# Altium project gituar.PrjPcb
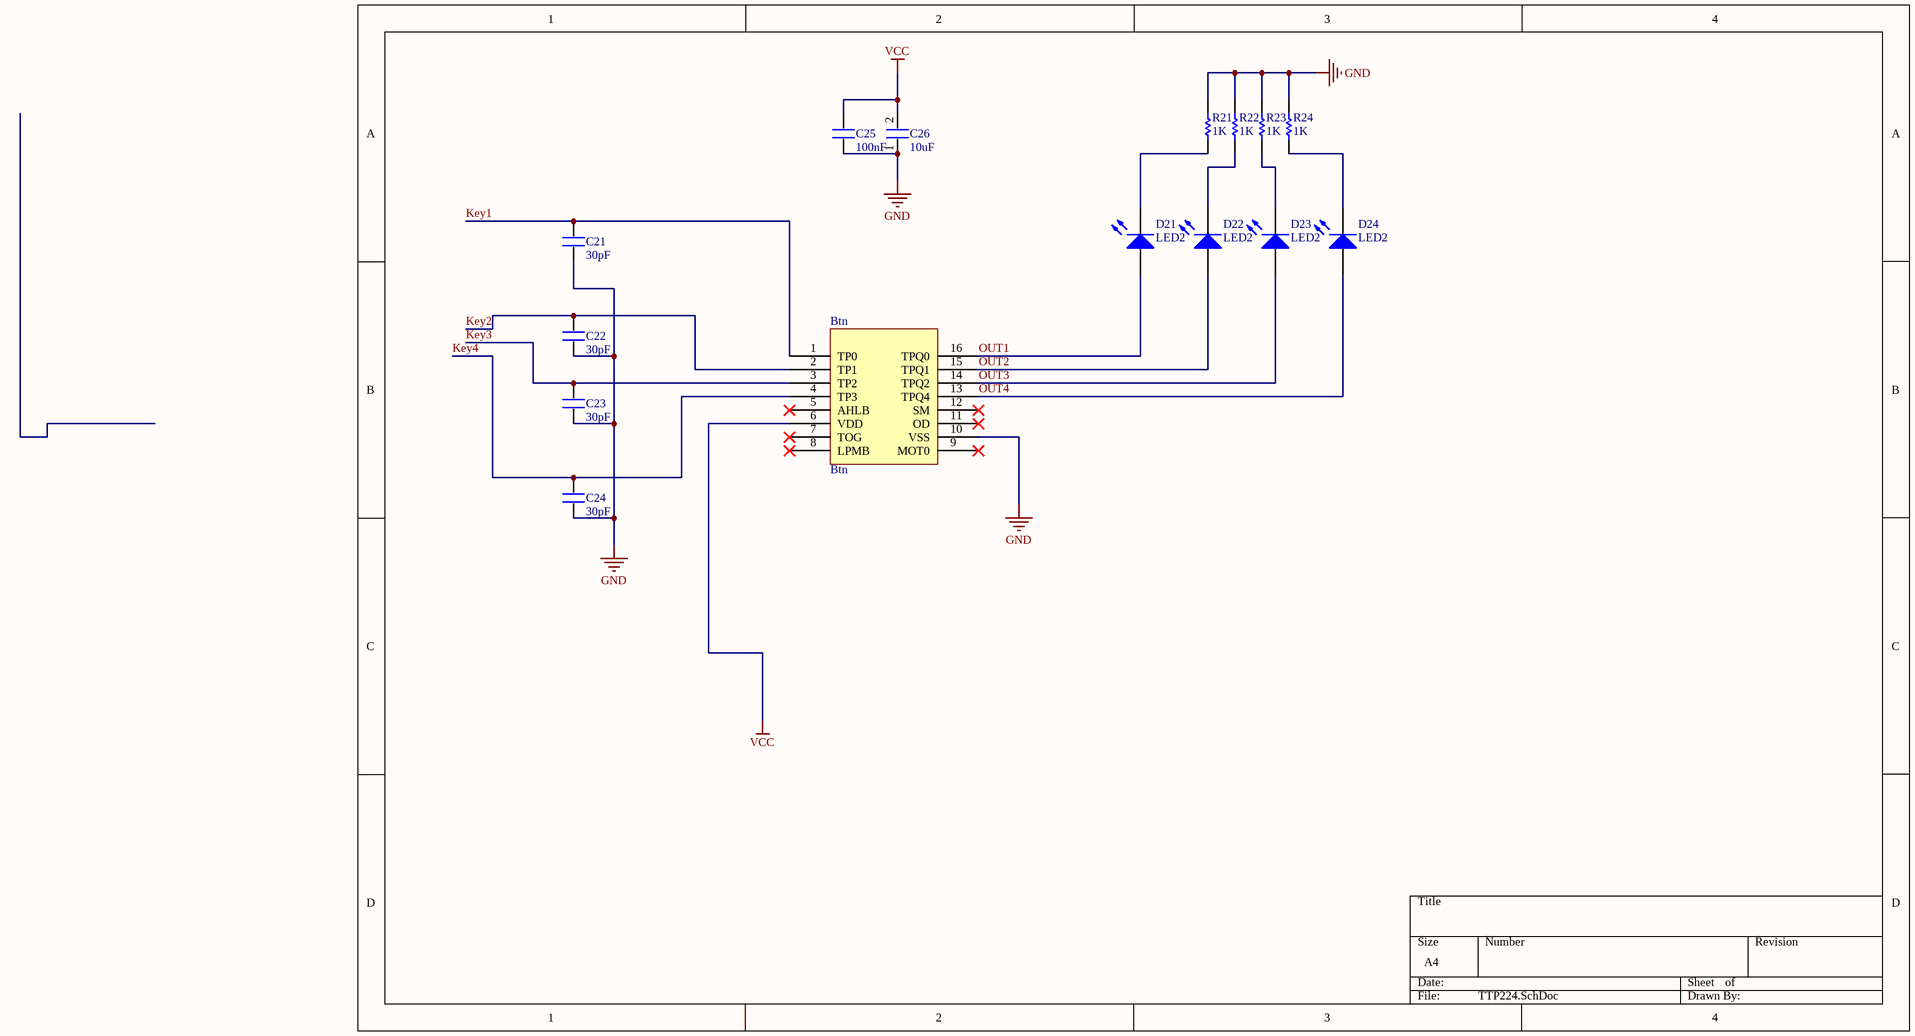
[diagram p0: TTP224.SchDoc]
2 sheets, 47 parts. Net scope: global (net labels, ports and power ports of the same name join across sheets).
Board file: PCB-never.PcbDoc
Sheets:
  TTP224.SchDoc
  Sheet1.SchDoc

## Sheet TTP224.SchDoc
size A4; SheetNumber: 1; SheetTotal: 2

### Parts
Btn  Btn  [SOP64P600X175-16N]
C21  value 30pF  [0805]  (hidden comment: CAP)
C22  value 30pF  [0805]  (hidden comment: CAP)
C23  value 30pF  [0805]  (hidden comment: CAP)
C24  value 30pF  [0805]  (hidden comment: CAP)
C25  value 100nF  [0805]  (hidden comment: CAP)
C26  value 10uF  [0805]  (hidden comment: CAP)
D21  LED2  [3.2X1.6X1.1]
D22  LED2  [3.2X1.6X1.1]
D23  LED2  [3.2X1.6X1.1]
D24  LED2  [3.2X1.6X1.1]
R21  Vaule: 1K  [0805]  (hidden comment: RES)
R22  Vaule: 1K  [0805]  (hidden comment: RES)
R23  Vaule: 1K  [0805]  (hidden comment: RES)
R24  Vaule: 1K  [0805]  (hidden comment: RES)

### Nets
GND: Btn.10(VSS) C21.1 C22.1 C23.1 C24.1 C25.1 C26.1 R21.2 R22.2 R23.2 R24.2
VCC: Btn.6(VDD) C25.2 C26.2
Key1: Btn.1(TP0) C21.2
Key2: Btn.2(TP1) C22.2
Key3: Btn.3(TP2) C23.2
Key4: Btn.4(TP3) C24.2
OUT1: Btn.16(TPQ0) D21.1(A)
OUT2: Btn.15(TPQ1) D22.1(A)
OUT3: Btn.14(TPQ2) D23.1(A)
OUT4: Btn.13(TPQ4) D24.1(A)
NetD21_2: D21.2(K) R21.1
NetD22_2: D22.2(K) R22.1
NetD23_2: D23.2(K) R23.1
NetD24_2: D24.2(K) R24.1

Not connected (* = marked no-connect by the designer): Btn 5(AHLB)* 7(TOG)* 8(LPMB)* 9(MOT0)* 11(OD)* 12(SM)*

### Library data of the parts
C21-C26 = CAP: Capacitor
D21-D24 = LED2: Typical RED, GREEN, YELLOW, AMBER GaAs LED; Published: 8-Jun-2000; LatestRevisionDate: 17-Jul-2002; LatestRevisionNote: Re-released for DXP Platform.; PackageVersion: Feb-2002; PackageReference: 3.2X1.6X1.1; Publisher: Altium Limited; PackageDescription: SM LED; 2 Flat Leads
R21-R24 = RES: Resistor

## Sheet Sheet1.SchDoc
size A4; SheetNumber: 2; SheetTotal: 2
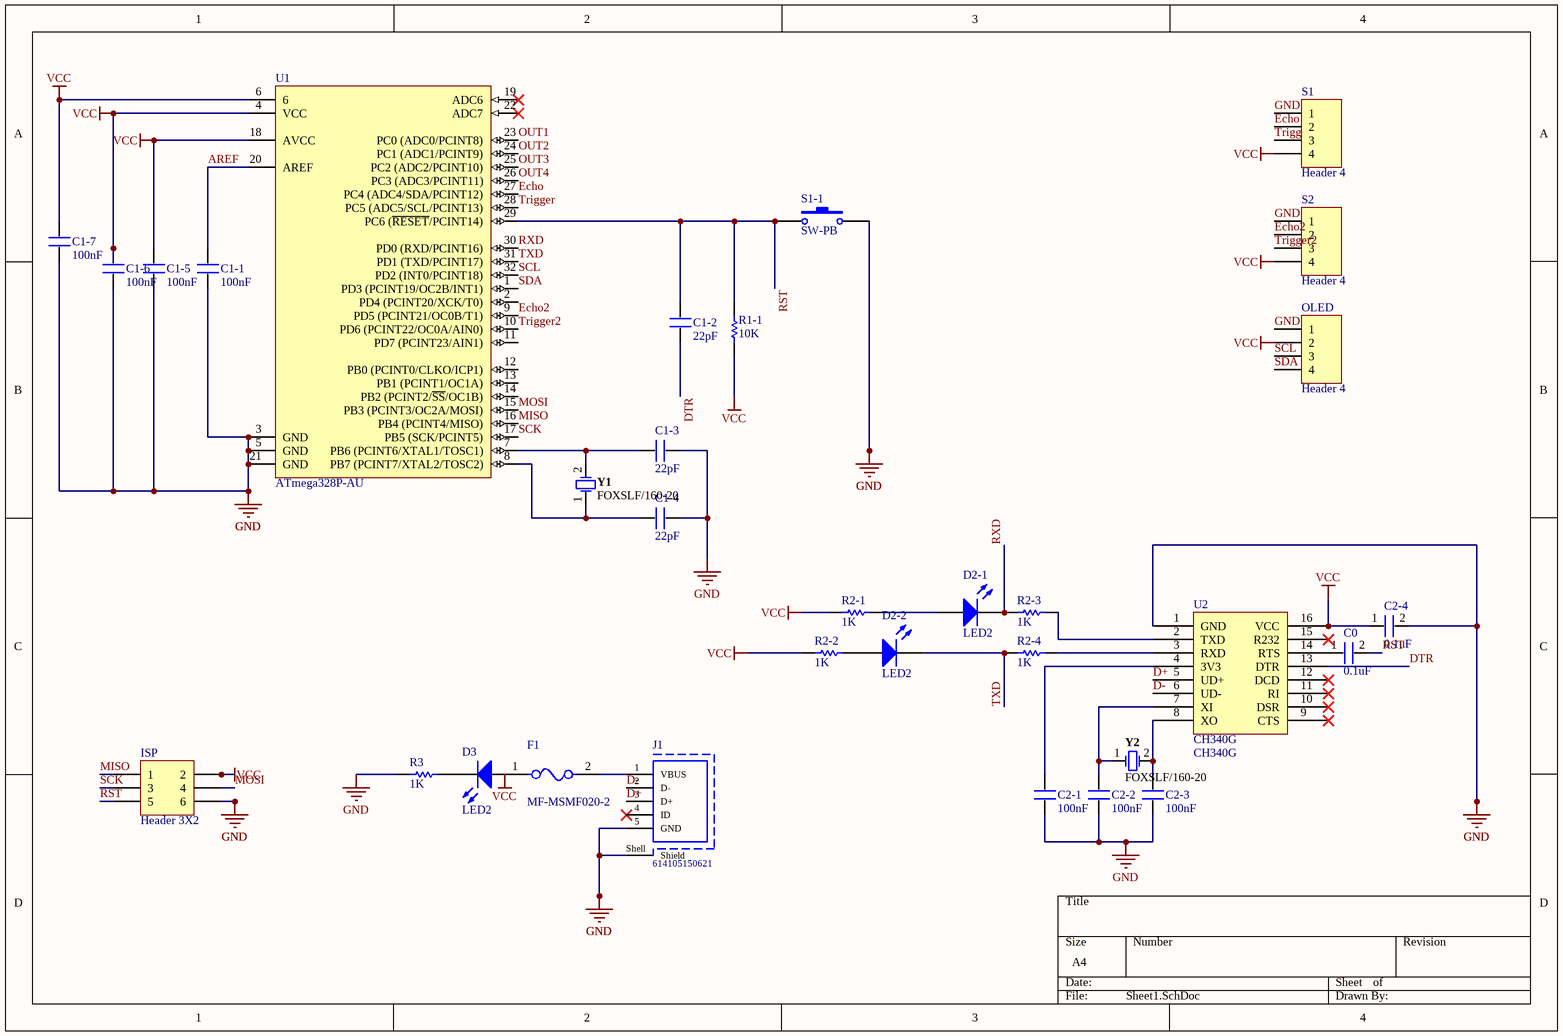
[diagram p1: Sheet1.SchDoc]

### Parts
C0  value 0.1uF  [0805]  (hidden comment: CAP)
C1-1  value 100nF  [0805]  (hidden comment: CAP)
C1-2  value 22pF  [0805]  (hidden comment: CAP)
C1-3  value 22pF  [0805]  (hidden comment: CAP)
C1-4  value 22pF  [0805]  (hidden comment: CAP)
C1-5  value 100nF  [0805]  (hidden comment: CAP)
C1-6  value 100nF  [0805]  (hidden comment: CAP)
C1-7  value 100nF  [0805]  (hidden comment: CAP)
C2-1  value 100nF  [0805]  (hidden comment: CAP)
C2-2  value 100nF  [0805]  (hidden comment: CAP)
C2-3  value 100nF  [0805]  (hidden comment: CAP)
C2-4  value 0.1uF  [0805]  (hidden comment: CAP)
D2-1  LED2  [3.2X1.6X1.1]
D2-2  LED2  [3.2X1.6X1.1]
D3  LED2  [3.2X1.6X1.1]
F1  MF-MSMF020-2  [FP-MF-MSMF020-2-MFG]
ISP  Header 3X2  [HDR2X3]
J1  614105150621  [629105150921]
OLED  Header 4  [HDR1X4]
R1-1  Vaule: 10K  [0805]  (hidden comment: RES)
R2-1  Vaule: 1K  [0805]  (hidden comment: RES)
R2-2  Vaule: 1K  [0805]  (hidden comment: RES)
R2-3  Vaule: 1K  [0805]  (hidden comment: RES)
R2-4  Vaule: 1K  [0805]  (hidden comment: RES)
R3  Vaule: 1K  [0805]  (hidden comment: RES)
S1  Header 4  [HDR1X4]
S1-1  SW-PB  [SPST-2]
S2  Header 4  [HDR1X4]
U1  ATmega328P-AU  [32A_L - duplicate]
U2  CH340G  [SOIC127P600X170-16N]
Y1  FOXSLF/160-20  [FOX-FOXSLF160-20]
Y2  FOXSLF/160-20  [FOX-FOXSLF160-20]

### Nets
GND: C1-1.1 C1-3.2 C1-4.2 C1-5.1 C1-6.1 C1-7.1 C2-1.1 C2-2.1 C2-3.1 C2-4.2 ISP.6 J1.5(GND) J1.Shell(Shield) OLED.1 R3.1 S1.1 S1-1.2 S2.1 U1.3(GND) U1.5(GND) U1.21(GND) U2.1(GND)
VCC: C1-5.2 C1-6.2 C1-7.2 C2-4.1 F1.1 ISP.2 OLED.2 R1-1.2 R2-1.1 R2-2.1 S1.4 S2.4 U1.4(VCC) U1.6 U1.18(AVCC) U2.16(VCC)
AREF: C1-1.2 U1.20(AREF)
D+: J1.3(D+) U2.5(UD+)
D-: J1.2(D-) U2.6(UD-)
DTR: C1-2.1 U2.13(DTR)
Echo: S1.2 U1.27(PC4_(ADC4/SDA/PCINT12))
Echo2: S2.2 U1.9(PD5_(PCINT21/OC0B/T1))
MISO: ISP.1 U1.16(PB4_(PCINT4/MISO))
MOSI: ISP.4 U1.15(PB3_(PCINT3/OC2A/MOSI))
OUT1: U1.23(PC0_(ADC0/PCINT8))
OUT2: U1.24(PC1_(ADC1/PCINT9))
OUT3: U1.25(PC2_(ADC2/PCINT10))
OUT4: U1.26(PC3_(ADC3/PCINT11))
RST: C0.2 C1-2.2 ISP.5 R1-1.1 S1-1.1 U1.29(PC6_(~{RESET}/PCINT14))
RXD: D2-1.2(K) R2-3.1 U1.30(PD0_(RXD/PCINT16))
SCK: ISP.3 U1.17(PB5_(SCK/PCINT5))
SCL: OLED.3 U1.32(PD2_(INT0/PCINT18))
SDA: OLED.4 U1.1(PD3_(PCINT19/OC2B/INT1))
Trigger: S1.3 U1.28(PC5_(ADC5/SCL/PCINT13))
Trigger2: S2.3 U1.10(PD6_(PCINT22/OC0A/AIN0))
TXD: D2-2.2(K) R2-4.1 U1.31(PD1_(TXD/PCINT17))
NetC0_1: C0.1 U2.14(RTS)
NetC1-3_1: C1-3.1 U1.7(PB6_(PCINT6/XTAL1/TOSC1)) Y1.2
NetC1-4_1: C1-4.1 U1.8(PB7_(PCINT7/XTAL2/TOSC2)) Y1.1
NetC2-1_2: C2-1.2 U2.4(3V3)
NetC2-2_2: C2-2.2 U2.7(XI) Y2.1
NetC2-3_2: C2-3.2 U2.8(XO) Y2.2
NetD2-1_1: D2-1.1(A) R2-1.2
NetD2-2_1: D2-2.1(A) R2-2.2
NetD3_2: D3.2(K) R3.2
NetF1_2: F1.2 J1.1(VBUS)
NetR2-3_2: R2-3.2 U2.2(TXD)
NetR2-4_2: R2-4.2 U2.3(RXD)

Not connected (* = marked no-connect by the designer): D3 1(A); J1 4(ID)*; U1 2(PD4_(PCINT20/XCK/T0)) 11(PD7_(PCINT23/AIN1)) 12(PB0_(PCINT0/CLKO/ICP1)) 13(PB1_(PCINT1/OC1A)) 14(PB2_(PCINT2/~{SS}/OC1B)) 19(ADC6)* 22(ADC7)*; U2 9(CTS)* 10(DSR)* 11(RI)* 12(DCD)* 15(R232)*

### Library data of the parts
C0 C1-1-C1-7 C2-1-C2-4 = CAP: Capacitor
D2-1 D2-2 D3 = LED2: as D21 on sheet TTP224; Published: 8-Jun-2000; LatestRevisionDate: 17-Jul-2002; LatestRevisionNote: Re-released for DXP Platform.; PackageVersion: Feb-2002; PackageReference: 3.2X1.6X1.1; Publisher: Altium Limited; PackageDescription: SM LED; 2 Flat Leads
F1 = CMP-07400-000027-1: PTC RESET FUSE 30V 200MA 1812; Manufacturer: Bourns; Hold Current: 0.2A; Current Rating: 80A; Trip Time: 0.06s; Resistance: 0.4-6Ω; Automotive Grade: Grade 3; Trip Current: 0.4A; Value: 0.4-6Ω; RoHS: TRUE; Digikey Description: PTC RESET FUSE 30V 200MA 1812; Device Class L3: unset; ComponentLink2Description: Datasheet; Manufacturer Part Number: MF-MSMF020-2; Temperature Range Low: -40°C; Automotive: Yes; Package: MF-MSMF020-2; ComponentLink2URL: https://www.bourns.com/docs/Product-Datasheets/mfmsmf.pdf; Lead Free: Yes; Temperature: -40°C to +85°C; Temperature Range High: +85°C; Device Class L1: Circuit Protection; Octopart: https://octopart.com/mf-msmf020-2-bourns-19289; Voltage Rating: 30V; Height: 1.1mm; Device Class L2: PTC Resettable Fuses; Category: Fuse; Mouser Description: Resettable Fuses - PPTC 0.2A 30V 0.40ohm
ISP = Header 3X2: Header, 3-Pin, Dual row; LatestRevisionDate: 17-Jul-2002; LatestRevisionNote: Re-released for DXP Platform.; Publisher: Altium Limited
J1 = CMP-1502-03251-1: Micro USB 2.0 Type AB Receptacle WR-COM, Vertical, THT; Manufacturer: Wurth Elektronik; Rated Current: 1.8A; Working Voltage: 30VAC; Contact Resistance: 30mOhm; Manufacturer URL: http://www.we-online.de; Orientation: Vertical; Packaging: TapeandReel; Package Reference: 614105150621; Part Number: 614105150621; Operating Temperature: -40to85degC; Connector Type: MicroUSB2.0TypeAB; Gender: Receptacle; Mounting Technology: THT; Datasheet URL: https://katalog.we-online.de/em/datasheet/614105150621.pdf; Publisher: WurthElektronik
OLED S1 S2 = Header 4: Header, 4-Pin; LatestRevisionDate: 17-Jul-2002; LatestRevisionNote: Re-released for DXP Platform.; Publisher: Altium Limited
R1-1 R2-1-R2-4 R3 = RES: Resistor
S1-1 = SW-PB: Switch; Published: 24-Mar-1999; LatestRevisionDate: 17-Jul-2002; LatestRevisionNote: Re-released for DXP Platform.; PackageReference: SPST-2; Publisher: Altium Limited; PackageDescription: Switch; 2 Leads
U1 = CMP-0095-00269-2: 8-bit AVR Microcontroller, 32KB Flash, 1KB EEPROM, 2KB SRAM, 32-pin TQFP, Industrial Grade (-40°C to 85°C); PackageDescription: 32-Lead, 7x7x1.0 mm Body, 0.8mm Lead Pitch, Thin Profile Plastic Quad Flat Package (TQFP); DatasheetVersion: revD, May-2011; RevisionNote: DatasheetVersion & PackageVersion updated. URLs added.; ComponentLink1URL: http://www.atmel.com/; ComponentLink2Description: ATmega48A/48PA/88A/88PA/168A/168PA/328/328P Datasheet; Code_JEDEC: MS-026-ABA; ComponentLink1Description: Manufacturer URL; PackageReference: 32A; ComponentLink3Description: ATmega48A/48PA/88A/88PA/168A/168PA/328/328P Summary; ComponentLink2URL: http://www.atmel.com/dyn/resources/prod_documents/doc8271.pdf; PackageVersion: revC, Oct-2010; ComponentLink3URL: http://www.atmel.com/dyn/resources/prod_documents/8271S.pdf
Y1 Y2 = CMP-1749-00003-1: Resistance Weld Thru-Hole Crystal, 16 MHz, -20 to 70 degC, 2-Pin THD, RoHS, Bulk; Voltage Rating: 250 V; Tolerance: 1%; Resistance: 221 kohm; Case\Package: Axial; Power Rating: 250 mW; RoHSCompliant: true; Package Quantity: 200; Packaging: Bulk; Min Operating Temperature: -55 degC; DatasheetVersion: Mar-15; ComponentLink1URL: http://www.foxonline.com/; Max Operating Temperature: 155 degC; PackageReference: FOXSLF160-20; Mount: Through Hole; PackageDescription: 2-Pin Through Hole Device, Body 11.35 x 4.65 mm; ComponentLink1Description: Manufacturer URL; ComponentLink2URL: http://www.foxonline.com/pdfs/hc49slf.pdf; ComponentLink2Description: Datasheet; Length: 0.248 inch

## Nets that join several sheets
GND: TTP224 (11 pins), Sheet1 (22 pins)
VCC: TTP224 (Btn.6 C25.2 C26.2), Sheet1 (16 pins)
OUT1: TTP224 (Btn.16 D21.1), Sheet1 (U1.23)
OUT2: TTP224 (Btn.15 D22.1), Sheet1 (U1.24)
OUT3: TTP224 (Btn.14 D23.1), Sheet1 (U1.25)
OUT4: TTP224 (Btn.13 D24.1), Sheet1 (U1.26)